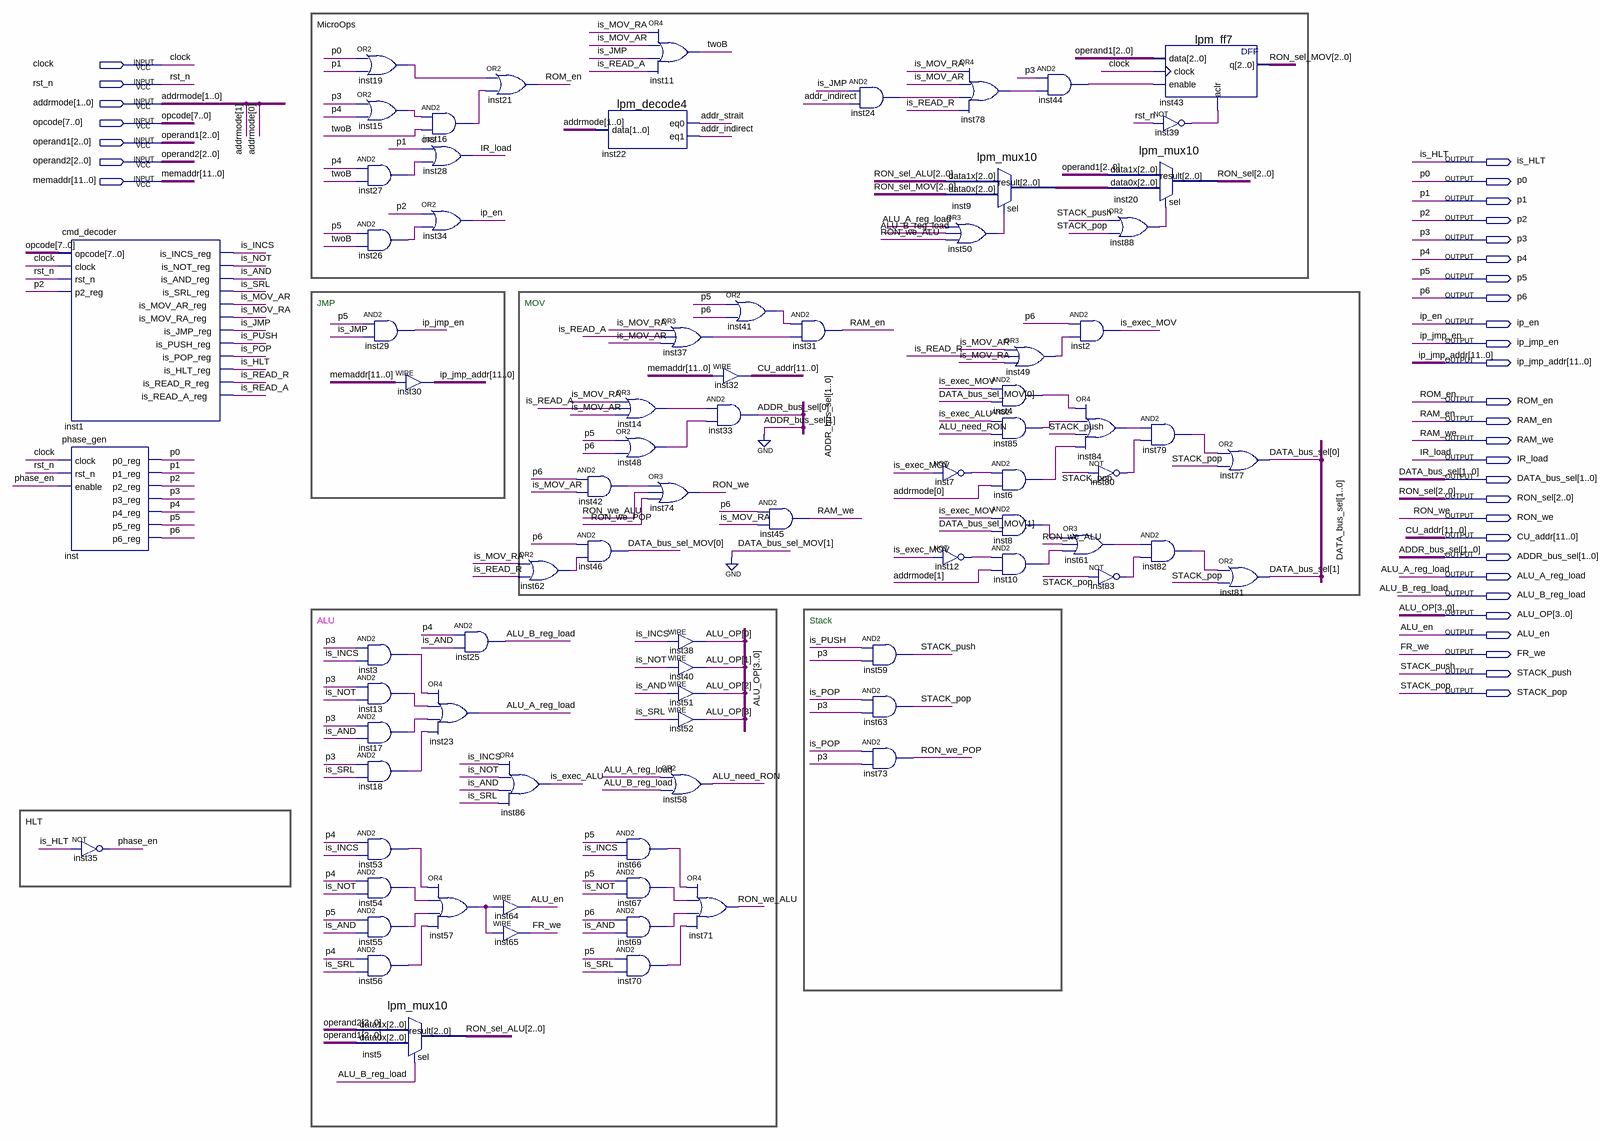
[diagram p0: schematic sheet]
// Quartus schematic CONTROL.bdf as structural Verilog: 81 symbols, 34 pins
module CONTROL (
  input  clock,
  input  rst_n,
  input  [1:0] addrmode,
  input  [7:0] opcode,
  input  [2:0] operand1,
  input  [2:0] operand2,
  input  [11:0] memaddr,
  output is_HLT,
  output p0,
  output p1,
  output p2,
  output p3,
  output p4,
  output p5,
  output p6,
  output ip_en,
  output ip_jmp_en,
  output [11:0] ip_jmp_addr,
  output ROM_en,
  output RAM_en,
  output RAM_we,
  output IR_load,
  output [1:0] DATA_bus_sel,
  output [2:0] RON_sel,
  output RON_we,
  output [11:0] CU_addr,
  output [1:0] ADDR_bus_sel,
  output ALU_A_reg_load,
  output ALU_B_reg_load,
  output [3:0] ALU_OP,
  output ALU_en,
  output FR_we,
  output STACK_push,
  output STACK_pop
);

  wire addr_indirect, addr_strait, ALU_need_RON, inst3_out, inst4_out, inst6_out, inst7_out, inst8_out,
       inst10_out, inst12_out, inst13_out, inst14_out, inst15_out, inst16_out, inst17_out, inst18_out,
       inst19_out, inst24_out, inst26_out, inst27_out, inst37_out, inst39_out, inst41_out, inst42_out,
       inst44_out, inst48_out, inst49_out, inst50_out, inst53_out, inst54_out, inst55_out, inst56_out,
       inst57_out, inst61_out, inst62_out, inst66_out, inst67_out, inst69_out, inst70_out, inst78_out,
       inst79_out, inst80_out, inst82_out, inst83_out, inst84_out, inst85_out, inst88_out, is_AND,
       is_exec_ALU, is_exec_MOV, is_INCS, is_JMP, is_MOV_AR, is_MOV_RA, is_NOT, is_POP, is_PUSH, is_READ_A,
       is_READ_R, is_SRL, phase_en, RON_we_ALU, RON_we_POP, twoB;
  wire [0:0] DATA_bus_sel_MOV;
  wire [2:0] inst9_result, RON_sel_ALU, RON_sel_MOV;

  cmd_decoder inst1 (
    .opcode(opcode), .clock(clock), .rst_n(rst_n), .p2_reg(p2), .is_INCS_reg(is_INCS), .is_NOT_reg(is_NOT),
    .is_AND_reg(is_AND), .is_SRL_reg(is_SRL), .is_MOV_AR_reg(is_MOV_AR), .is_MOV_RA_reg(is_MOV_RA),
    .is_JMP_reg(is_JMP), .is_PUSH_reg(is_PUSH), .is_POP_reg(is_POP), .is_HLT_reg(is_HLT),
    .is_READ_R_reg(is_READ_R), .is_READ_A_reg(is_READ_A));
  phase_gen inst (
    .clock(clock), .rst_n(rst_n), .enable(phase_en), .p0_reg(p0), .p1_reg(p1), .p2_reg(p2), .p3_reg(p3),
    .p4_reg(p4), .p5_reg(p5), .p6_reg(p6));
  not inst35 (phase_en, is_HLT);
  or inst19 (inst19_out, p0, p1);
  or inst15 (inst15_out, p3, p4);
  and inst27 (inst27_out, p4, twoB);
  and inst26 (inst26_out, p5, twoB);
  and inst29 (ip_jmp_en, p5, is_JMP);
  and inst3 (inst3_out, p3, is_INCS);
  and inst13 (inst13_out, p3, is_NOT);
  and inst17 (inst17_out, p3, is_AND);
  and inst18 (inst18_out, p3, is_SRL);
  and inst53 (inst53_out, p4, is_INCS);
  and inst54 (inst54_out, p4, is_NOT);
  and inst55 (inst55_out, p5, is_AND);
  and inst56 (inst56_out, p4, is_SRL);
  lpm_mux10 inst5 (.data1x(operand2), .data0x(operand1), .sel(ALU_B_reg_load), .result(RON_sel_ALU));
  assign ip_jmp_addr = memaddr;  // WIRE inst30
  and inst16 (inst16_out, inst15_out, twoB);
  or inst28 (IR_load, p1, inst27_out);
  or inst34 (ip_en, p2, inst26_out);
  and inst25 (ALU_B_reg_load, p4, is_AND);
  or inst23 (ALU_A_reg_load, inst3_out, inst13_out, inst17_out, inst18_out);
  or inst57 (inst57_out, inst53_out, inst54_out, inst55_out, inst56_out);
  or inst21 (ROM_en, inst19_out, inst16_out);
  or inst62 (inst62_out, is_MOV_RA, is_READ_R);
  or inst86 (is_exec_ALU, is_INCS, is_NOT, is_AND, is_SRL);
  assign ALU_en = inst57_out;  // WIRE inst64
  assign FR_we = inst57_out;  // WIRE inst65
  lpm_decode4 inst22 (.data(addrmode), .eq0(addr_strait), .eq1(addr_indirect));
  or inst14 (inst14_out, is_MOV_RA, is_READ_A, is_MOV_AR);
  or inst48 (inst48_out, p5, p6);
  and inst42 (inst42_out, p6, is_MOV_AR);
  and inst46 (DATA_bus_sel_MOV[0], p6, inst62_out);
  and inst66 (inst66_out, p5, is_INCS);
  and inst67 (inst67_out, p5, is_NOT);
  and inst69 (inst69_out, p6, is_AND);
  and inst70 (inst70_out, p5, is_SRL);
  or inst11 (twoB, is_MOV_RA, is_MOV_AR, is_JMP, is_READ_A);
  or inst37 (inst37_out, is_MOV_RA, is_READ_A, is_MOV_AR);
  or inst74 (RON_we, inst42_out, RON_we_ALU, RON_we_POP);
  assign ALU_OP[0] = is_INCS;  // WIRE inst38
  assign ALU_OP[1] = is_NOT;  // WIRE inst40
  assign ALU_OP[2] = is_AND;  // WIRE inst51
  assign ALU_OP[3] = is_SRL;  // WIRE inst52
  or inst58 (ALU_need_RON, ALU_A_reg_load, ALU_B_reg_load);
  or inst41 (inst41_out, p5, p6);
  assign CU_addr = memaddr;  // WIRE inst32
  and inst33 (ADDR_bus_sel[0], inst14_out, inst48_out);
  or inst71 (RON_we_ALU, inst66_out, inst67_out, inst69_out, inst70_out);
  and inst45 (RAM_we, p6, is_MOV_RA);
  and inst31 (RAM_en, inst41_out, inst37_out);
  and inst24 (inst24_out, is_JMP, addr_indirect);
  and inst59 (STACK_push, is_PUSH, p3);
  and inst63 (STACK_pop, is_POP, p3);
  and inst73 (RON_we_POP, is_POP, p3);
  not inst7 (inst7_out, is_exec_MOV);
  not inst12 (inst12_out, is_exec_MOV);
  or inst78 (inst78_out, is_MOV_RA, is_MOV_AR, inst24_out, is_READ_R);
  lpm_mux10 inst9 (.data1x(RON_sel_ALU), .data0x(RON_sel_MOV), .sel(inst50_out), .result(inst9_result));
  or inst50 (inst50_out, ALU_A_reg_load, ALU_B_reg_load, RON_we_ALU);
  and inst44 (inst44_out, p3, inst78_out);
  or inst49 (inst49_out, is_MOV_AR, is_READ_R, is_MOV_RA);
  and inst4 (inst4_out, is_exec_MOV, DATA_bus_sel_MOV[0]);
  and inst85 (inst85_out, is_exec_ALU, ALU_need_RON);
  and inst6 (inst6_out, inst7_out, addrmode[0]);
  and inst8 (inst8_out, is_exec_MOV, 1'b0);
  and inst10 (inst10_out, inst12_out, addrmode[1]);
  and inst2 (is_exec_MOV, p6, inst49_out);
  or inst84 (inst84_out, inst4_out, inst85_out, STACK_push, inst6_out);
  not inst80 (inst80_out, STACK_pop);
  or inst61 (inst61_out, inst8_out, RON_we_ALU, inst10_out);
  not inst83 (inst83_out, STACK_pop);
  lpm_mux10 inst20 (.data1x(operand1), .data0x(inst9_result), .sel(inst88_out), .result(RON_sel));
  or inst88 (inst88_out, STACK_push, STACK_pop);
  and inst79 (inst79_out, inst84_out, inst80_out);
  and inst82 (inst82_out, inst61_out, inst83_out);
  lpm_ff7 inst43 (.data(operand1), .clock(clock), .enable(inst44_out), .aclr(inst39_out), .q(RON_sel_MOV));
  not inst39 (inst39_out, rst_n);
  or inst77 (DATA_bus_sel[0], inst79_out, STACK_pop);
  or inst81 (DATA_bus_sel[1], inst82_out, STACK_pop);

  assign ADDR_bus_sel[1] = 1'b0;

  // Notes on the sheet:
  //   MicroOps
  //   JMP
  //   MOV
  //   ALU
  //   Stack
  //   HLT
endmodule
